# EAGLE schematic Schematic_Sensing_Module (EAGLE 9.6.2)
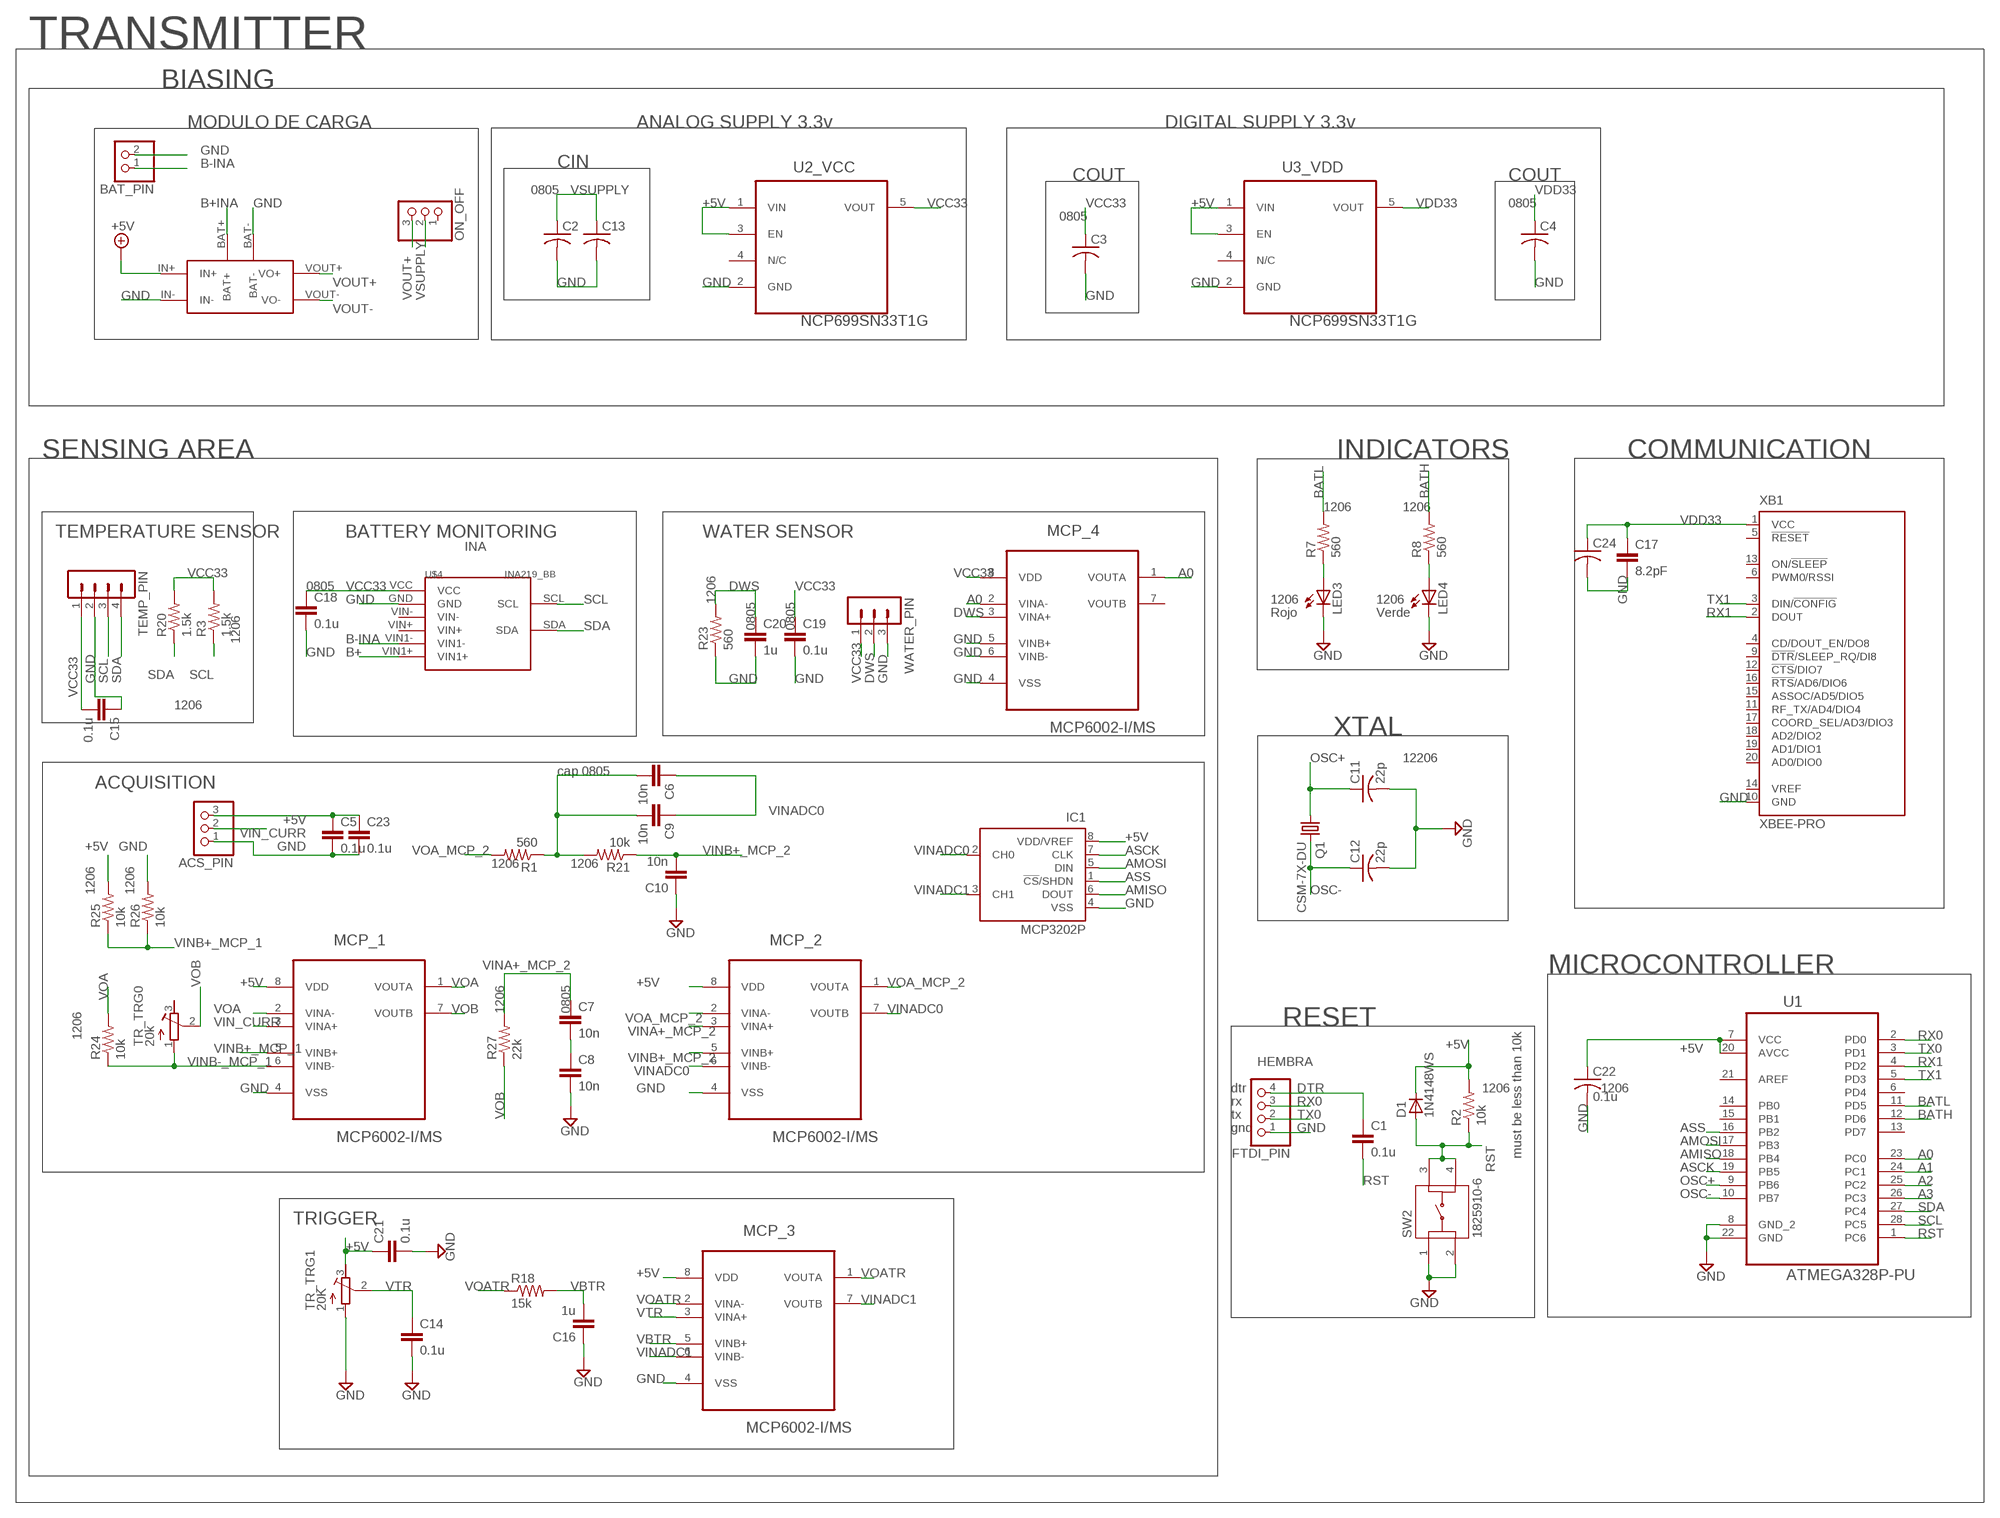
[diagram p0: schematic, sheet 1]

## Parts
ACS_PIN  PINHD-1X3  [1X03]
BAT_PIN  PINHD-1X2  [1X02]
C1  0.1u  C-EUC0805  [C0805]
C2  C-USC0805  [C0805]
C3  C-USC0805  [C0805]
C4  C-USC0805  [C0805]
C5  0.1u  C-EUC0805  [C0805]
C6  10n  C-EUC0805  [C0805]
C7  10n  C-EUC0805  [C0805]
C8  10n  C-EUC0805  [C0805]
C9  10n  C-EUC0805  [C0805]
C10  10n  C-EUC0805  [C0805]
C11  22p  C-USC1206  [C1206]
C12  22p  C-USC1206  [C1206]
C13  C-USC0805  [C0805]
C14  0.1u  C-EUC0805  [C0805]
C15  0.1u  C-EUC0805  [C0805]
C16  1u  C-EUC0805  [C0805]
C17  8.2pF  C-EUC0805  [C0805]
C18  0.1u  C-EUC0805  [C0805]
C19  0.1u  C-EUC0805  [C0805]
C20  1u  C-EUC0805  [C0805]
C21  0.1u  C-EUC0805  [C0805]
C22  0.1u  C-USC1206  [C1206]
C23  0.1u  C-EUC0805  [C0805]
C24  C-USC0805  [C0805]
D1  1N4148WS  [SOD323]
FTDI_PIN  PINHD-1X4  [1X04]
IC1  MCP3202P  [DIL8]
LED3  LEDCHIPLED_1206  [CHIPLED_1206]
LED4  LEDCHIPLED_1206  [CHIPLED_1206]
MCP_1  MCP6002-I/MS  [SOP65P490X110-8N]
MCP_2  MCP6002-I/MS  [SOP65P490X110-8N]
MCP_3  MCP6002-I/MS  [SOP65P490X110-8N]
MCP_4  MCP6002-I/MS  [SOP65P490X110-8N]
ON_OFF  PINHD-1X3  [1X03]
Q1  CSM-7X-DU  [CSM-7X-DU]
R1  560  R-US_R1206  [R1206]
R2  10k  R-US_R1206  [R1206]
R3  1.5k  R-US_R1206  [R1206]
R7  560  R-US_R1206  [R1206]
R8  560  R-US_R1206  [R1206]
R18  15k  R-US_R0805  [R0805]
R20  1.5k  R-US_R1206  [R1206]
R21  10k  R-US_R1206  [R1206]
R23  560  R-US_R1206  [R1206]
R24  10k  R-US_R1206  [R1206]
R25  10k  R-US_R1206  [R1206]
R26  10k  R-US_R1206  [R1206]
R27  22k  R-US_R1206  [R1206]
SW2  1825910-6  [SW_1825910-6-4]
TEMP_PIN  MA04-1  [MA04-1]
TR_TRG0  20k  R-TRIMM64W  [RTRIM64W]
TR_TRG1  20K  R-TRIMM64W  [RTRIM64W]
U1  ATMEGA328P-PU  [DIP254P762X457-28]
U2_VCC  NCP699SN33T1G  [SOT95P275X110-5N]
U3_VDD  NCP699SN33T1G  [SOT95P275X110-5N]
U$1  MODULO_CARGA_DEVICE  [MODULO_CARGA]
U$4  INA219_BB  [INA219_BB]
WATER_PIN  MA03-1  [MA03-1]
XB1  XBEE-PRO  [XBEE-PRO]

## Nets
+5V: ACS_PIN.3 C5.1 C21.1 C22.1 C23.1 D1.C IC1.8(VDD/VREF) MCP_1.8(VDD) MCP_2.8(VDD) MCP_3.8(VDD) R2.2 R25.2 TR_TRG1.3(E) U1.7(VCC) U1.20(AVCC) U2_VCC.1(VIN) U2_VCC.3(EN) U3_VDD.1(VIN) U3_VDD.3(EN) U$1.IN+
A0: MCP_4.1(VOUTA) MCP_4.2(VINA-) U1.23(PC0)
A1: U1.24(PC1)
A2: U1.25(PC2)
A3: U1.26(PC3)
AMISO: IC1.6(DOUT) U1.18(PB4)
AMOSI: IC1.5(DIN) U1.17(PB3)
ASCK: IC1.7(CLK) U1.19(PB5)
ASS: IC1.1(!CS!/SHDN) U1.16(PB2)
B+: U$4.VIN1+
B+INA: U$1.BAT+
B-INA: BAT_PIN.1 U$4.VIN1-
BATH: R8.2 U1.12(PD6)
BATL: R7.2 U1.11(PD5)
DTR: C1.1 FTDI_PIN.4
DWS: C20.1 MCP_4.3(VINA+) R23.2 WATER_PIN.2
GND: ACS_PIN.1 BAT_PIN.2 C2.2 C3.2 C4.2 C5.2 C8.2 C10.1 C11.2 C12.2 C13.2 C14.2 C15.1 C16.1 C17.2 C18.2 C19.2 C20.2 C21.2 C22.2 C23.2 C24.2 FTDI_PIN.1 IC1.4(VSS) LED3.C LED4.C MCP_1.4(VSS) MCP_2.4(VSS) MCP_3.4(VSS) MCP_4.4(VSS) MCP_4.5(VINB+) MCP_4.6(VINB-) R23.1 R26.2 SW2.1 SW2.2 TEMP_PIN.2 TR_TRG1.1(A) U1.8(GND_2) U1.22(GND) U2_VCC.2(GND) U3_VDD.2(GND) U$1.BAT- U$1.IN- U$4.GND WATER_PIN.3 XB1.10(GND)
N$3: LED3.A R7.1
N$4: LED4.A R8.1
N$5: C7.2 C8.1
N$13: C6.2 C9.2 R1.1 R21.2
OSC+: C11.1 Q1.1 U1.9(PB6)
OSC-: C12.1 Q1.2 U1.10(PB7)
RST: C1.2 D1.A R2.1 SW2.3 SW2.4 U1.1(PC6)
RX0: FTDI_PIN.3 U1.2(PD0)
RX1: U1.4(PD2) XB1.2(DOUT)
SCL: R3.1 TEMP_PIN.3 U1.28(PC5) U$4.SCL
SDA: R20.1 TEMP_PIN.4 U1.27(PC4) U$4.SDA
TX0: FTDI_PIN.2 U1.3(PD1)
TX1: U1.5(PD3) XB1.3(DIN/!CONFIG)
VBTR: C16.2 MCP_3.5(VINB+) R18.2
VCC33: C3.1 C15.2 C18.1 C19.1 MCP_4.8(VDD) R3.2 R20.2 TEMP_PIN.1 U2_VCC.5(VOUT) U$4.VCC WATER_PIN.1
VDD33: C4.1 C17.1 C24.1 U3_VDD.5(VOUT) XB1.1(VCC)
VIN_CURR: ACS_PIN.2 MCP_1.3(VINA+)
VINA+_MCP_2: C7.1 MCP_2.3(VINA+) R27.2
VINADC0: C6.1 C9.1 IC1.2(CH0) MCP_2.6(VINB-) MCP_2.7(VOUTB)
VINADC1: IC1.3(CH1) MCP_3.6(VINB-) MCP_3.7(VOUTB)
VINB+_MCP_1: MCP_1.5(VINB+) R25.1 R26.1
VINB+_MCP_2: C10.2 MCP_2.5(VINB+) R21.1
VINB-_MCP_1: MCP_1.6(VINB-) R24.1 TR_TRG0.1(A)
VOA: MCP_1.1(VOUTA) MCP_1.2(VINA-) R24.2
VOA_MCP_2: MCP_2.1(VOUTA) MCP_2.2(VINA-) R1.2
VOATR: MCP_3.1(VOUTA) MCP_3.2(VINA-) R18.1
VOB: MCP_1.7(VOUTB) R27.1 TR_TRG0.2(S)
VOUT+: ON_OFF.3 U$1.VOUT+(VO+)
VOUT-: U$1.VOUT-(VO-)
VSUPPLY: C2.1 C13.1 ON_OFF.2
VTR: C14.1 MCP_3.3(VINA+) TR_TRG1.2(S)
Unconnected: MCP_4.7(VOUTB) ON_OFF.1 TR_TRG0.3(E) U1.6(PD4) U1.13(PD7) U1.14(PB0) U1.15(PB1) U1.21(AREF) U2_VCC.4(N/C) U3_VDD.4(N/C) U$4.VIN+ U$4.VIN- XB1.4(CD/DOUT_EN/DO8) XB1.5(!RESET) XB1.6(PWM0/RSSI) XB1.9(!DTR!/SLEEP_RQ/DI8) XB1.11(RF_TX/AD4/DIO4) XB1.12(!CTS!/DIO7) XB1.13(ON/!SLEEP) XB1.14(VREF) XB1.15(ASSOC/AD5/DIO5) XB1.16(!RTS!/AD6/DIO6) XB1.17(COORD_SEL/AD3/DIO3) XB1.18(AD2/DIO2) XB1.19(AD1/DIO1) XB1.20(AD0/DIO0)

## Notes on the sheet
- TRANSMITTER
- BIASING
- MODULO DE CARGA | ANALOG SUPPLY 3.3v | DIGITAL SUPPLY 3.3v
- CIN
- COUT | COUT
- 0805
- 0805
- 0805
- SENSING AREA | INDICATORS | COMMUNICATION
- 1206 | 1206
- TEMPERATURE SENSOR | BATTERY MONITORING | WATER SENSOR
- INA
- 0805
- 1206 | 1206 | 1206
- Rojo | Verde
- 0805 | 0805
- 1206
- 1206
- XTAL
- 12206
- cap 0805
- ACQUISITION
- 1206 | 1206
- 1206 | 1206
- MICROCONTROLLER
- 1206 | 0805
- RESET
- 1206
- HEMBRA
- dtr | 1206 | 1206
- rx
- tx
- gnd
- must be less than 10k
- TRIGGER

## Library data of the parts
ACS_PIN ON_OFF = pinhead:PINHD-1X3: PIN HEADER
BAT_PIN = pinhead:PINHD-1X2: PIN HEADER
C1 C5-C10 C14-C21 C23 = rcl:C-EU: CAPACITOR, European symbol
C2-C4 C11-C13 C22 C24 = rcl:C-US: CAPACITOR, American symbol
D1 = 1N4148WS:1N4148WS: http://octopart.com/1n4148ws-fairchild+semiconductor-7851016; AVAILABILITY: Unavailable; DESCRIPTION: Diode Switching 75V 0.3A 2-Pin SOD-323 T/R; MF: ON Semiconductor; MP: 1N4148WS; PACKAGE: S-0 Good-Ark; PRICE: None
FTDI_PIN = pinhead:PINHD-1X4: PIN HEADER
IC1 = microchip:MCP3202: 2.7V Dual Channel 12-Bit A/D Converter with SPI Serial Interface Source: http://ww1.microchip.com/downloads/en/DeviceDoc/21034D.pdf; MF: MICROCHIP; MPN: MCP3202-CI/P; OC_FARNELL: 1196794; OC_NEWARK: 72K7287
LED3 LED4 = led:LED: LED OSRAM: - CHIPLED LG R971, LG N971, LY N971, LG Q971, LY Q971, LO R971, LY R971 LH N974, LH R974 LS Q976, LO Q976, LY Q976 LO Q996 - Hyper CHIPLED LW Q18S LB Q993, LB Q99A, LB R99A - SideLED LS A670, LO A670, LY A670, LG A670, LP A670 LB A673, LV A673, LT A673, LW A673 LH A674 LY A675 LS A676, LA A676, LO A676, LY A676, LW A676 LS A679, LY A679, LG A679 - Hyper Micro SIDELED® LS Y876, LA Y876, LO Y876, LY Y876 LT Y87S - SmartLED LW L88C, LW L88S LB L89C, LB L89S, LG L890 LS L89K, LO L89K, LY L89K LS L896, LA L896, LO L896, LY L896 - TOPLED LS T670, LO T670, LY T670, LG T670, LP T670 LSG T670, LSP T670, LSY T670, LOP T670, LYG T670 LG T671, LOG T671, LSG T671 LB T673, LV T673, LT T673, LW T673 LH T674 LS T676, LA T676, LO T676, LY T676, LB T676, LH T676, LSB T676, LW T676 LB T67C, LV T67C, LT T67C, LS T67K, LO T67K, LY T67K, LW E67C LS E67B, LA E67B, LO E67B, LY E67B, LB E67C, LV E67C, LT E67C LW T67C LS T679, LY T679, LG T679 LS T770, LO T770, LY T770, LG T770, LP T770 LB T773, LV T773, LT T773, LW T773 LH T774 LS E675, LA E675, LY E675, LS T675 LS T776, LA T776, LO T776, LY T776, LB T776 LHGB T686 LT T68C, LB T68C - Hyper Mini TOPLED® LB M676 - Mini TOPLED Santana® LG M470 LS M47K, LO M47K, LY M47K Source: http://www.osram.convergy.de LUXEON: - LUMILED® LXK2-PW12-R00, LXK2-PW12-S00, LXK2-PW14-U00, LXK2-PW14-V00 LXK2-PM12-R00, LXK2-PM12-S00, LXK2-PM14-U00 LXK2-PE12-Q00, LXK2-PE12-R00, LXK2-PE12-S00, LXK2-PE14-T00, LXK2-PE14-U00 LXK2-PB12-K00, LXK2-PB12-L00, LXK2-PB12-M00, LXK2-PB14-N00, LXK2-PB14-P00, LXK2-PB14-Q00 LXK2-PR12-L00, LXK2-PR12-M00, LXK2-PR14-Q00, LXK2-PR14-R00 LXK2-PD12-Q00, LXK2-PD12-R00, LXK2-PD12-S00 LXK2-PH12-R00, LXK2-PH12-S00 LXK2-PL12-P00, LXK2-PL12-Q00, LXK2-PL12-R00 Source: www.luxeon.com KINGBRIGHT: KA-3528ASYC Source: www.kingbright.com
MCP_1 = MCP6002-I_MS-2:MCP6002-I/MS: Low-Power Op Amp; AVAILABILITY: Unavailable; DESCRIPTION: Microchip MCP6002-I/MS, Dual Op Amp, 1MHzCMOS, Rail to Rail, 3V, 5V, 8-Pin MSOP; MF: Microchip; MP: MCP6002-I/MS; PACKAGE: MSOP-8 Microchip; PRICE: None
MCP_2-MCP_4 = MCP6002-I_MS:MCP6002-I/MS: Low-Power Op Amp; DESCRIPTION: Microchip MCP6002-I/MS, Dual Op Amp, 1MHzCMOS, Rail to Rail, 3V, 5V, 8-Pin MSOP; DIGI-KEY_PART_NUMBER: MCP6002-I/MS-ND; DIGI-KEY_PURCHASE_URL: https://www.digikey.com.co/product-detail/en/microchip-technology/MCP6002-I-MS/MCP6002-I-MS-ND/500874?utm_source=snapeda&utm_medium=aggregator&utm_campaign=symbol; MF: Microchip; MP: MCP6002-I/MS; PACKAGE: MSOP-8 Microchip
Q1 = crystal:CSM-7X-DU: SMD CRYSTAL Source: www.ecsxtal.com .. Crystal 3.6864MHz CSM_7X_DU.PDF; OC_FARNELL: unknown; OC_NEWARK: unknown
R1-R3 R7 R8 R20 R21 R23-R27 = rcl:R-US_: RESISTOR, American symbol
R18 = resistor:R-US_: RESISTOR, American symbol
SW2 = button1825910-6:1825910-6: Switch Tactile OFF (ON) SPST Round Button PC Pins 0.05A 24VDC 100000Cycles 1.57N Thru-Hole Loose; AVAILABILITY: Unavailable; COMMENT: 1825910-6; CONFIGURATION_POLE-THROW: Single Pole - Single Throw; CONTACT_CURRENT_RATING: 50 mA; DESCRIPTION: Switch Push Button OFF _ON_ SPST Round Button 0.05A 24VDC Momentary Contact PC Pins Thru-Hole; EU_ROHS_COMPLIANCE: Compliant; MF: TE Connectivity; MP: 1825910-6; PACKAGE: None; PRICE: None; TE_PURCHASE_URL: https://www.te.com/usa-en/product-1825910-6.html?te_bu=Cor&te_type=disp&te_campaign=seda_glo_cor-seda-global-disp-prtnr-fy19-seda-model-bom-cta_sma-317_1&elqCampaignId=32493
TEMP_PIN = con-lstb:MA04-1: PIN HEADER; OC_FARNELL: unknown; OC_NEWARK: unknown
TR_TRG0 TR_TRG1 = rcl:R-TRIMM: Trimm resistor
U1 = Atmel_By_element14_Batch_1-00:ATMEGA328P-PU: 8-bit Microcontroller with In-System Programmable Flash; MPN: ATMEGA328P-PU; OC_FARNELL: 1715487; OC_NEWARK: 15R0268; PACKAGE: PDIP-28; SUPPLIER: Atmel
U2_VCC U3_VDD = NCP699SN33T1G:NCP699SN33T1G: 150 mA CMOS Low Iq LDO with Enable; DESCRIPTION: Linear Voltage Regulator, CMOS LDO, Low Iq and Low IGND, 150 mA, with Enable Vout: 3.3 V; DIGI-KEY_PART_NUMBER: NCP699SN33T1GOSCT-ND; DIGI-KEY_PURCHASE_URL: https://www.digikey.com.co/product-detail/en/on-semiconductor/NCP699SN33T1G/NCP699SN33T1GOSCT-ND/1630380?utm_source=snapeda&utm_medium=aggregator&utm_campaign=symbol; MF: ON Semiconductor; MP: NCP699SN33T1G; PACKAGE: TSOP-5 ON Semiconductor
U$1 = Modulo_Carga:MODULO_CARGA_DEVICE
U$4 = INA219_BB:INA219_BB
WATER_PIN = con-lstb:MA03-1: PIN HEADER; OC_FARNELL: unknown; OC_NEWARK: unknown
XB1 = maxstream:XBEE: XBee (TM) /XBee-PRO(TM) OEM RF Modules Source: MaxStream, Inc. xbee_productmanual.pdf; MPN: XBP24-AWI-001; OC_FARNELL: 1337916; OC_NEWARK: 42M2667